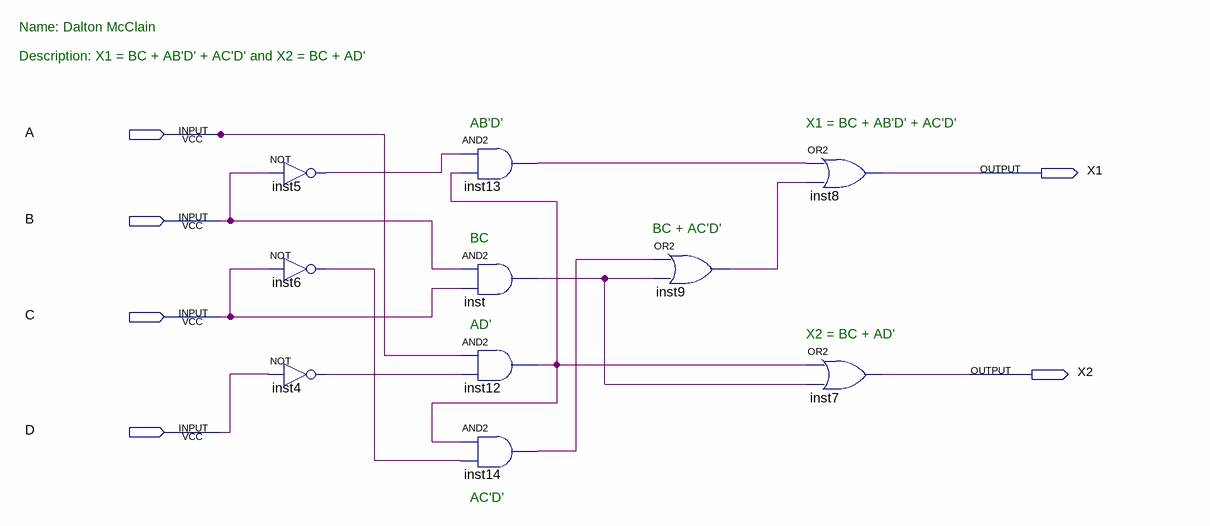
[diagram p0: schematic sheet]
// Quartus schematic Lab1.bdf as structural Verilog: 10 symbols, 6 pins
module Lab1 (
  input  A,
  input  B,
  input  C,
  input  D,
  output X1,
  output X2
);

  wire inst4_out, inst5_out, inst6_out, inst9_out, inst12_out, inst13_out, inst14_out, inst_out;

  not inst5 (inst5_out, B);
  not inst6 (inst6_out, C);
  not inst4 (inst4_out, D);
  and inst13 (inst13_out, inst5_out, inst12_out);
  and inst (inst_out, B, C);
  and inst12 (inst12_out, A, inst4_out);
  and inst14 (inst14_out, inst12_out, inst6_out);
  or inst9 (inst9_out, inst14_out, inst_out);
  or inst8 (X1, inst13_out, inst9_out);
  or inst7 (X2, inst12_out, inst_out);

  // Notes on the sheet:
  //   Name: Dalton McClain
  //   Description: X1 = BC + AB'D' + AC'D' and X2 = BC + AD'
  //   AB'D'
  //   X1 = BC + AB'D' + AC'D'
  //   BC + AC'D'
  //   BC
  //   AD'
  //   X2 = BC + AD'
  //   AC'D'
endmodule
